# EAGLE design MQTT_meteo_v2.0 (EAGLE 9.0.1)
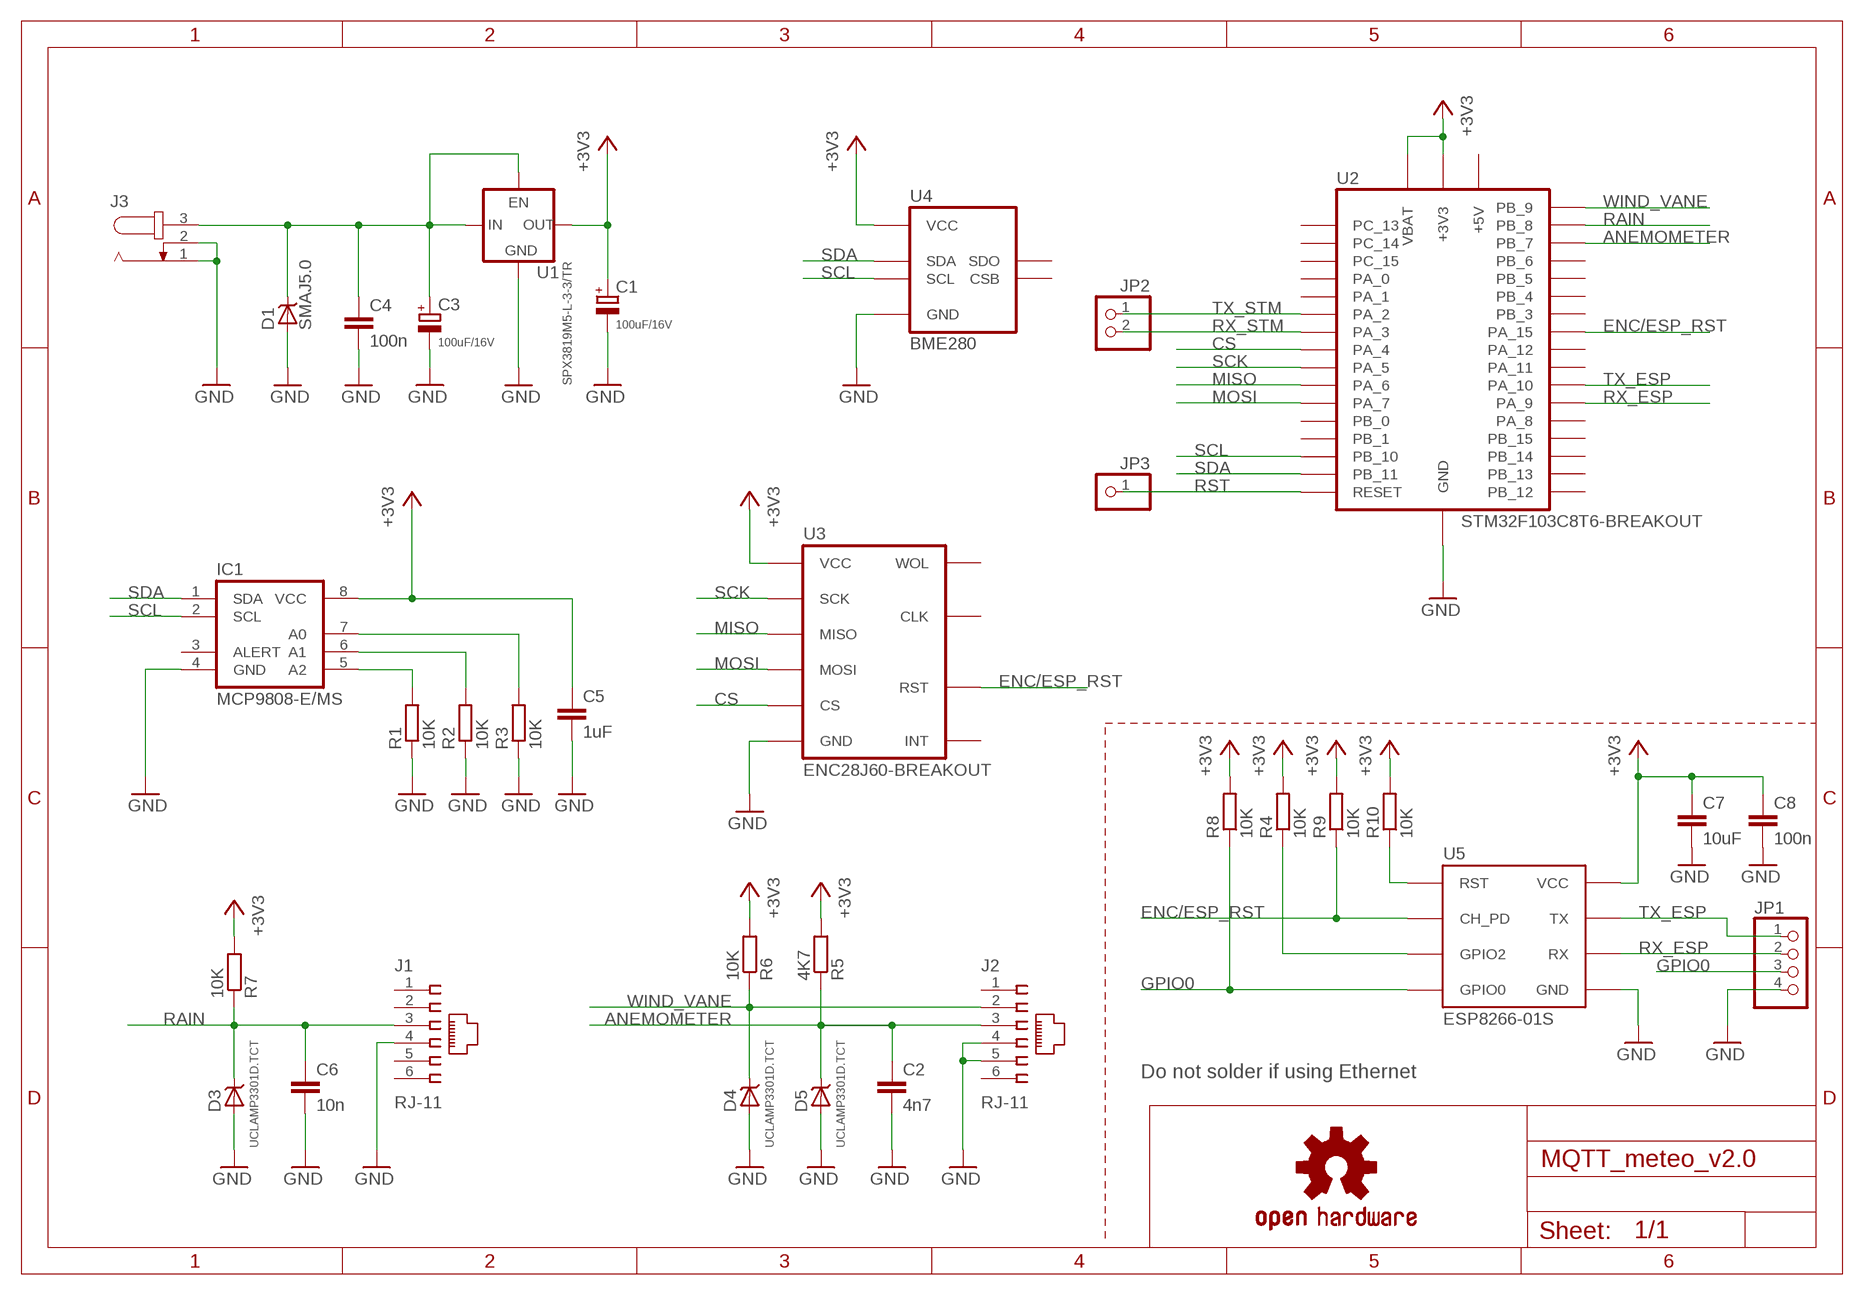
[diagram p0: schematic, sheet 1]

## Parts
C1  100uF/16V  CPOL-EUE2-5  [E2-5]
C2  4n7  C-EUC0805  [C0805]
C3  100uF/16V  CPOL-EUE2-5  [E2-5]
C4  100n  C-EUC0805  [C0805]
C5  1uF  C-EUC0805  [C0805]
C6  10n  C-EUC0805  [C0805]
C7  10uF  C-EUC0805  [C0805]
C8  100n  C-EUC0805  [C0805]
D1  SMAJ5.0  [DO214AC]
D3  UCLAMP3301D.TCT  [SOD323]
D4  UCLAMP3301D.TCT  [SOD323]
D5  UCLAMP3301D.TCT  [SOD323]
IC1  MCP9808-E/MS  [MSOP8]
J1  RJ-11  [615006138421]
J2  RJ-11  [615006138421]
J3  JACK-PLUG1  [SPC4078]
JP1  PINHD-1X4  [1X04]
JP2  PINHD-1X2  [1X02]
JP3  PINHD-1X01_2.54-90°  [1X01/90]
LOGO1  OSHW-LOGOM-COPPER  [OSHW-LOGO-M_COPPER]
R1  10K  R-EU_R0805  [R0805]
R2  10K  R-EU_R0805  [R0805]
R3  10K  R-EU_R0805  [R0805]
R4  10K  R-EU_R0805  [R0805]
R5  4K7  R-EU_R0805  [R0805]
R6  10K  R-EU_R0805  [R0805]
R7  10K  R-EU_R0805  [R0805]
R8  10K  R-EU_R0805  [R0805]
R9  10K  R-EU_R0805  [R0805]
R10  10K  R-EU_R0805  [R0805]
U1  SPX3819M5-L-3-3/TR  TLV70033DD  [SOT23-5]
U2  STM32F103C8T6-BREAKOUT  [STM32F103C8T6]
U3  ENC28J60-BREAKOUT  [ENC28J60]
U4  BME280  [BM*280]
U5  ESP8266-01S  [ESP-01]

## Nets
+3V3: C1.+ C5.1 C7.1 C8.1 IC1.8(VCC) R4.2 R5.2 R6.2 R7.2 R8.2 R9.2 R10.2 U1.5(VOUT) U2.+3V3 U2.+3V3@1(+3V3) U2.VBAT U3.VCC U4.VCC U5.VCC
ANEMOMETER: C2.1 D5.C J2.3 R5.1 U2.PB_7
CS: U2.PA_4 U3.CS
ENC/ESP_RST: R9.1 U2.PA_15 U3.RST U5.CH_PD
GND: C1.- C2.2 C3.- C4.2 C5.2 C6.2 C7.2 C8.2 D1.A D3.A D4.A D5.A IC1.4(GND) J1.4 J2.4 J2.5 J3.1 J3.2 JP1.4 R1.1 R2.1 R3.1 U1.2(GND) U2.GND U2.GND@1(GND) U2.GND@2(GND) U3.GND U4.GND U5.GND
GPIO0: JP1.3 R8.1 U5.GPIO0
MISO: U2.PA_6 U3.SO(MISO)
MOSI: U2.PA_7 U3.SI(MOSI)
N$1: R4.1 U5.GPIO2
N$3: IC1.5(A2) R1.2
N$4: IC1.6(A1) R2.2
N$5: R10.1 U5.RST
N$6: IC1.7(A0) R3.2
RAIN: C6.1 D3.C J1.3 R7.1 U2.PB_8
RST: JP3.1 U2.RESET
RX_ESP: JP1.2 U2.PA_9 U5.RX
RX_STM: JP2.2 U2.PA_3
SCK: U2.PA_5 U3.SCK
SCL: IC1.2(SCL) U2.PB_10 U4.SCL
SDA: IC1.1(SDA) U2.PB_11 U4.SDA
TX_ESP: JP1.1 U2.PA_10 U5.TX
TX_STM: JP2.1 U2.PA_2
VIN: C3.+ C4.1 D1.C J3.3 U1.1(VIN) U1.3(EN)
WIND_VANE: D4.C J2.2 R6.1 U2.PB_9
Unconnected: IC1.3(ALERT) J1.1 J1.2 J1.5 J1.6 J2.1 J2.6 U2.PA_0 U2.PA_1 U2.PA_8 U2.PA_11 U2.PA_12 U2.PB_0 U2.PB_1 U2.PB_3 U2.PB_4 U2.PB_5 U2.PB_6 U2.PB_12 U2.PB_13 U2.PB_14 U2.PB_15 U2.PC_13 U2.PC_14 U2.PC_15 U3.CLK U3.NT(INT) U3.WOL U4.CSB U4.SDO

## Notes on the sheet
- Do not solder if using Ethernet

## Power pins joined to a net without a drawn wire
+5V: U2.+5V

## Library data of the parts
C1 C3 = rcl:CPOL-EU: POLARIZED CAPACITOR, European symbol; SPICEPREFIX: C
C2 C4-C8 = rcl:C-EU: CAPACITOR, European symbol; SPICEPREFIX: C
D1 = my-diode:SM?J*: Transient Voltage Suppression Diode - TVS
D3-D5 = my-diode:UCLAMP3301?.TCT: Low Voltage μClamp TVS diode
IC1 = my-ic:MCP9808-E/?: I2C Digital Temperature Sensor
J1 J2 = my-connectors:RJ-11
J3 = con-jack:JACK-PLUG: DC POWER JACK Power Jack, DC, Right Angle, Through Hole, Rated 5A at 16VDC, PC Terminals Distributor: Farnell (www.Farnell.de) Drawing: 84N1161.pdf / 84N1162.pdf Manufacturer: SPC Technology (www.spctechnology.com) Type: SPC4077 / SPC 4078; OC_FARNELL: unknown; OC_NEWARK: unknown
JP1 = pinhead:PINHD-1X4: PIN HEADER
JP2 = pinhead:PINHD-1X2: PIN HEADER
JP3 = pinhead-2:PINHD-1X01: PIN HEADER
LOGO1 = SparkFun-Aesthetics:OSHW-LOGO: Open-Source Hardware (OSHW) Logo This logo indicates the piece of hardware it is found on incorporates a OSHW license and/or adheres to the definition of open source hardware found here: http://freedomdefined.org/OSHW
R1-R10 = rcl:R-EU_: RESISTOR, European symbol; SPICEPREFIX: R
U1 = my-power:TLV700*: LDO regulator 200mA
U2 = my-modules:STM32F103C8T6-BREAKOUT: 32bit ARM processor breakout board
U3 = my-modules:ENC28J60-BREAKOUT: SPI Ethernet module
U4 = my-modules:BM*280: Pressure/Temp Sensor
U5 = my-ESP8266:ESP8266-01

## Board
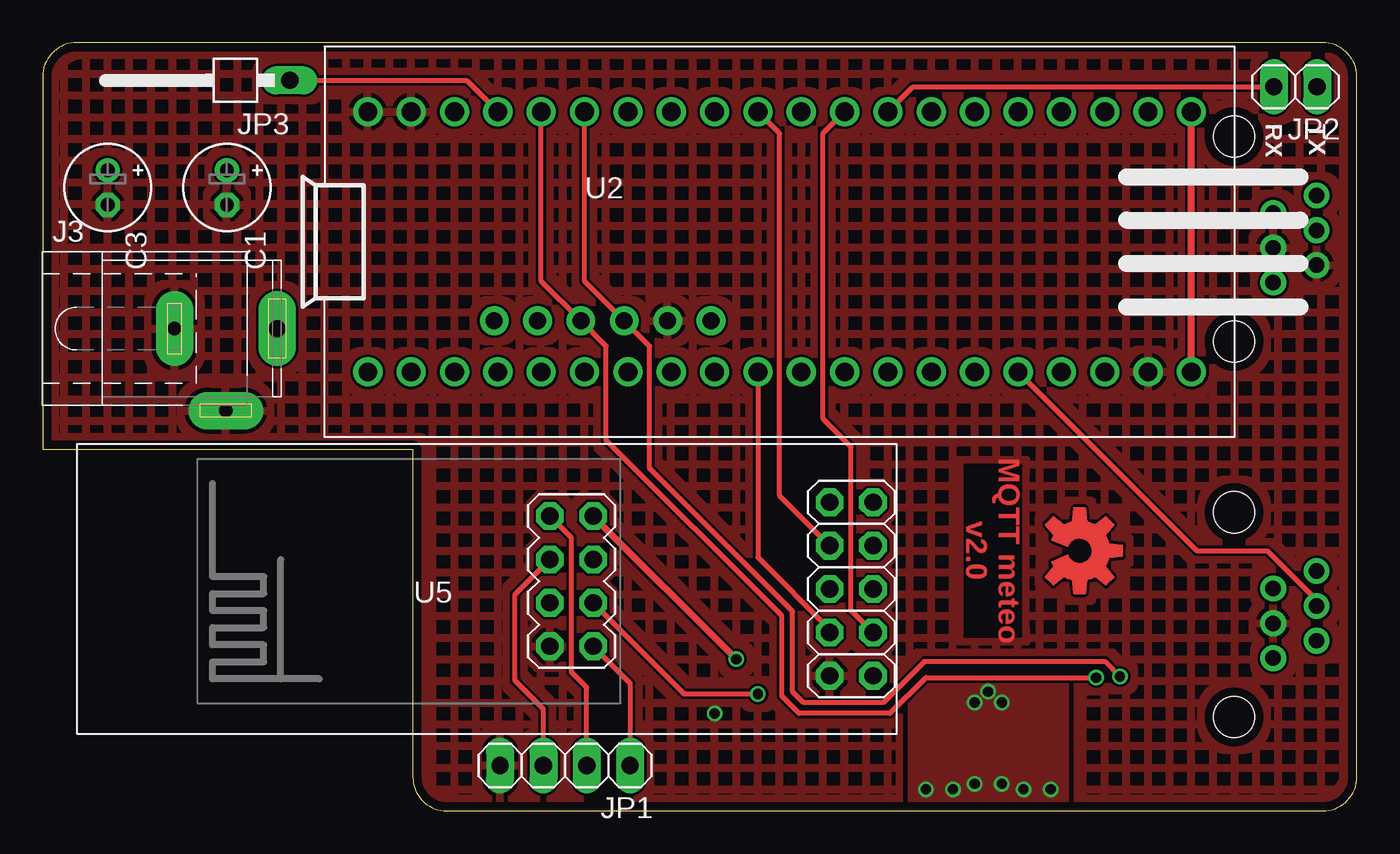
[diagram p1: board, top side]
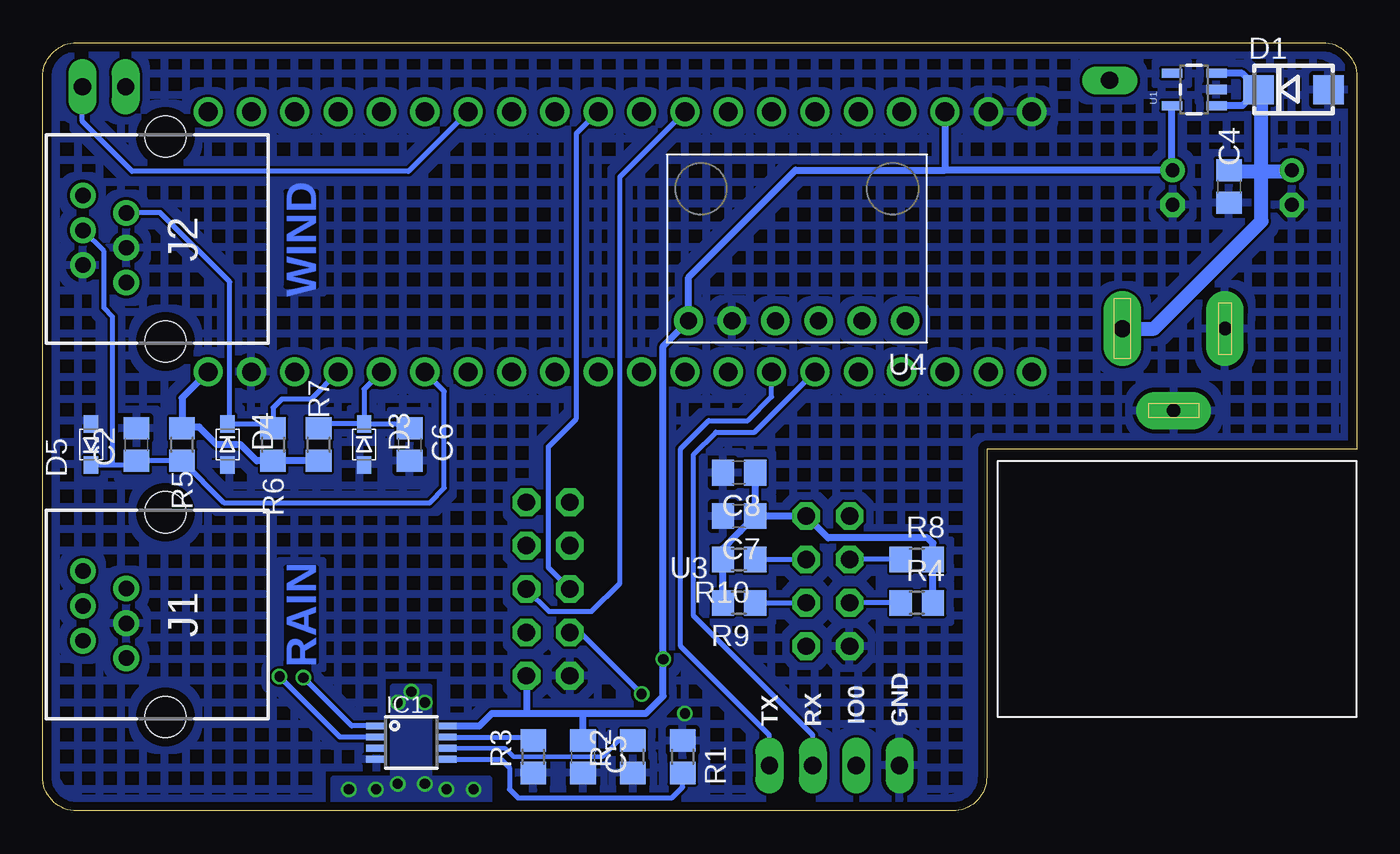
[diagram p2: board, bottom side, seen from below]

Size 77 x 45 mm. Coordinates in mm from the lower left corner, seen from the top.
Outline: 21.68,21.18 21.68,2 arc90 23.68,0 75,0 arc90 77,2 77,43 arc90 75,45 2,45 arc90 0,43 0,21.18 21.68,21.18
Copper layers (1*16): Top 0.035mm / dielectric 1.6mm / Bottom 0.035mm
Design rules "Elecrow_2-layer_PCB_eagle_rule *": minimum track width 6mil, minimum drill 12mil, track to track 6mil, track to pad 6mil, pad to pad 6mil, via to via 8mil, smd to smd 0mil, copper to edge 20mil, drill to drill 10mil, minimum pad ring 12mil, minimum via ring 6mil, stop-mask expansion 0mil, vias tented up to drill 100mil, thermal gap 10mil

### Footprints (pad centres in the part's own frame; a part is rotated, then mirrored left to right if it is on the bottom)
E2-5 = drill 0.813 pad 1.27: + -1.016,0 | drill 0.813 pad 1.27 octagon: - 1.016,0
C0805 = smd 1.3 x 1.5: 1 -0.95,0; 2 0.95,0
DO214AC = smd 1.8 x 1.7: A 2.05,0; C -2.05,0
SOD323 = smd 1.03 x 0.839: A 1.206,0; C -1.206,0
MSOP8 = smd 0.4 x 1.2: 1 -0.975,-2.05; 2 -0.325,-2.05; 3 0.325,-2.05; 4 0.975,-2.05; 5 0.975,2.05; 6 0.325,2.05; 7 -0.325,2.05; 8 -0.975,2.05
615006138421 = drill 0.9: 1 2.55,4.34; 2 1.53,1.8; 3 0.51,4.34; 4 -0.51,1.8; 5 -1.53,4.34; 6 -2.55,1.8 | hole 2.4: -6,-0.5; 6,-0.5
SPC4078 = drill 0.8 pad 2.184 long: 1 -3,0; 2 0,-4.8 | drill 1 pad 2.184 long: 3 3,0
1X04 = drill 1.016 long: 1 -3.81,0; 2 -1.27,0; 3 1.27,0; 4 3.81,0
1X02 = drill 1.016 long: 1 -1.27,0; 2 1.27,0
1X01/90 = drill 1.016 long: 1 -1.27,-3.81
R0805 = smd 1.3 x 1.5: 1 -0.95,0; 2 0.95,0
SOT23-5 = smd 0.55 x 1.2: 1 -0.95,-1.3; 2 0,-1.3; 3 0.95,-1.3; 4 0.95,1.3; 5 -0.95,1.3
STM32F103C8T6 = drill 1.1 pad 1.676: +3V3 -7.62,-19.05; +3V3@1 7.62,24.13; +5V 7.62,19.05; GND -7.62,-24.13; GND@1 -7.62,-21.59; GND@2 7.62,21.59; PA_0 -7.62,13.97; PA_1 -7.62,11.43; PA_2 -7.62,8.89; PA_3 -7.62,6.35; PA_4 -7.62,3.81; PA_5 -7.62,1.27; PA_6 -7.62,-1.27; PA_7 -7.62,-3.81; PA_8 7.62,-13.97; PA_9 7.62,-11.43; PA_10 7.62,-8.89; PA_11 7.62,-6.35; PA_12 7.62,-3.81; PA_15 7.62,-1.27; PB_0 -7.62,-6.35; PB_1 -7.62,-8.89; PB_3 7.62,1.27; PB_4 7.62,3.81; PB_5 7.62,6.35; PB_6 7.62,8.89; PB_7 7.62,11.43; PB_8 7.62,13.97; PB_9 7.62,16.51; PB_10 -7.62,-11.43; PB_11 -7.62,-13.97; PB_12 7.62,-24.13; PB_13 7.62,-21.59; PB_14 7.62,-19.05; PB_15 7.62,-16.51; PC_13 -7.62,21.59; PC_14 -7.62,19.05; PC_15 -7.62,16.51; RESET -7.62,-16.51; VBAT -7.62,24.13
ENC28J60 = drill 1.016 octagon: CLK -23.622,5.08; CS -23.622,-2.54; GND -21.082,-5.08; NT -21.082,5.08; RST -21.082,-2.54; SCK -21.082,0; SI -23.622,0; SO -21.082,2.54; VCC -23.622,-5.08; WOL -23.622,2.54
BM*280 = drill 1 pad 1.676: CSB -3.81,3.81; GND 3.81,3.81; SCL 1.27,3.81; SDA -1.27,3.81; SDO -6.35,3.81; VCC 6.35,3.81
ESP-01 = drill 1.016 octagon: CH_PD -10.795,1.27; GND -8.255,3.81; GPIO0 -8.255,-1.27; GPIO2 -8.255,1.27; RST -10.795,-1.27; RX -8.255,-3.81; TX -10.795,3.81; VCC -10.795,-3.81

### Placement (x,y rotation side)
C1  10.79,36.51 270 top
C2  71.5,21.46 90 bottom
C3  3.81,36.51 270 top
C4  7.49,36.58 270 bottom
C5  45.34,3.17 270 bottom
C6  55.5,21.46 270 bottom
C7  36.2,17.27 180 bottom
C8  36.2,19.81 180 bottom
D1  3.71,42.25 0 bottom
D3  58.17,21.46 270 bottom
D4  66.17,21.46 270 bottom
D5  74.17,21.46 90 bottom
IC1  55.4,4 270 bottom
J1  70.3,11.5 90 bottom
J2  70.3,33.5 90 bottom
J3  10.73,28.25 0 top
JP1  30.61,2.67 180 top
JP2  73.41,42.42 180 top
JP3  10.67,44.07 90 top
LOGO1  60.76,15.24 270 top
R1  39.5,3.17 270 bottom
R2  42.42,3.17 90 bottom
R3  48.26,3.17 90 bottom
R4  25.78,12.19 0 bottom
R5  68.83,21.46 90 bottom
R6  63.5,21.46 270 bottom
R7  60.83,21.46 270 bottom
R8  25.78,14.73 0 bottom
R9  36.2,12.19 180 bottom
R10  36.2,14.73 180 bottom
U1  9.53,42.26 90 bottom
U2  43.18,33.34 270 top
U3  25.03,13 0 bottom
U4  32.81,32.52 180 bottom
U5  21.46,13.46 180 top

### Tracks (layer width: path | path; a pad name or v marks a point on that pad's centre or on a via)
+3V3  (via drill 0.6)
  Top 0.406: U2.+3V3@1 U2.VBAT | U5.VCC v40.64,8.89
  Bottom 0.406: 24.13,37.53 C1.+ 10.83,37.56 U1.5 | IC1.8 51.41,4.98 50.67,5.71 48.64,5.71 | 48.64,5.71 45.34,5.71 | U3.VCC 48.65,5.73 48.64,5.71 | U2.+3V3@1 68.83,24.19 68.83,22.48 | 68.83,22.48 R5.2 | R7.2 R6.2 64.45,20.51 65.41,21.46 66.8,21.46 67.82,22.48 68.83,22.48 | 24.13,37.53 32.88,37.53 39.16,31.25 U4.VCC 40.64,27.23 v40.64,8.89 40.64,6.73 41.66,5.71 45.34,5.71 | U2.+3V3 24.13,37.53 | C5.1 45.34,5.71 | R4.2 R8.2 24.83,15.69 25.15,16 30.99,16 U5.VCC C7.1 | C7.1 36.14,16.38 36.35,16.17 37.15,15.37 R10.2 R9.2 | C7.1 C8.1
ANEMOMETER
  Bottom 0.305: 72.9,20.26 71.76,20.26 C2.1 R5.1 66.36,18.03 54.36,18.03 53.47,18.92 53.47,24.57 U2.PB_7 | 72.9,20.26 D5.C | J2.3 73.41,32.78 73.41,29.46 72.9,28.96 72.9,20.26
CS
  Top 0.305: U3.CS 47.37,11.74 47.37,21.34 45.72,22.99 45.72,39.69 U2.PA_4
ENC/ESP_RST  (via drill 0.6)
  Top 0.305: U5.CH_PD 37.59,6.86 v41.91,6.86 | U2.PA_15 41.91,14.86 46.11,10.65 U3.RST
  Bottom 0.305: R9.1 U5.CH_PD | v41.91,6.86 45.51,10.46 U3.RST
GND  (via drill 0.6)
  other vias: 39.37,5.71
  pour Bottom (hatched): 0,45 0,0 50.16,0 50.16,2.54 53.66,2.54 53.66,7.94 57.15,7.94 57.15,2.54 60.64,2.54 60.64,0 77,0 77,45
  pour Top (hatched): 0,0 0,45 77,45 77,0 60.64,0 60.64,8.26 51.44,8.26 50.16,6.99 50.16,0
GPIO0
  Top 0.305: JP1.3 29.34,5.97 27.69,7.62 27.69,12.7 U5.GPIO0
  Bottom 0.305: R8.1 U5.GPIO0
HEATSINK  (via drill 0.6)
  other vias: 54.61,6.35 54.61,1.59 56.2,1.59 56.2,6.35 53.34,1.27 51.75,1.27 57.47,1.27 59.05,1.27 55.4,6.99
  pour Bottom: 54.29,1.91 54.29,7.3 56.52,7.3 56.52,1.91 60.01,1.91 60.01,0 50.8,0 50.8,1.91
  pour Top: 60.01,7.62 52.07,7.62 50.8,6.35 50.8,0 60.01,0
MISO
  Top 0.305: U3.SO 43.18,18.47 43.18,39.69 U2.PA_6
MOSI
  Bottom 0.305: U3.SI 47.34,11.68 44.83,11.68 43.18,13.34 43.18,37.15 U2.PA_7
N$1
  Bottom 0.305: R4.1 U5.GPIO2
N$3
  Bottom 0.305: IC1.5 50.15,3.03 49.66,2.54 49.66,1.27 49.15,0.76 40.13,0.76 39.5,1.4 R1.2
N$4
  Bottom 0.254: R2.2 43.25,4.12 44.2,3.17 49.4,3.17 49.91,3.68 IC1.6
N$5
  Bottom 0.305: R10.1 U5.RST
N$6
  Bottom 0.305: IC1.7 48.47,4.33 R3.2
RAIN
  Top 0.305: U2.PB_8 67.63,15.24 71.75,15.24 74.64,12.36 J1.3
  Bottom 0.305: D3.C 55.76,22.67 C6.1 | D3.C 60.58,22.67 R7.1 | U2.PB_8 58.17,24.7 D3.C
RST
  Top 0.305: JP3.1 24.83,42.8 U2.RESET
RX_ESP
  Top 0.305: U5.RX 30.99,16 30.99,8.13 31.88,7.24 JP1.2
  Bottom 0.305: U2.PA_9 35.28,22.19 37.55,22.19 38.86,20.88 38.86,11.43 31.88,4.45 JP1.2
RX_STM
  Top 0.305: U2.PA_3 50.99,42.42 JP2.2
SCK
  Bottom 0.305: U3.SCK 47.37,14.26 47.37,21.34 45.72,22.99 45.72,39.69 U2.PA_5
SCL  (via drill 0.6)
  Top 0.305: v63.12,7.87 62.23,8.76 51.69,8.76 49.28,6.35 44.58,6.35 43.94,6.99 43.94,11.68 35.56,20.07 35.56,27.23 U4.SCL 31.75,31.04 U2.PB_10
  Bottom 0.305: IC1.2 59.58,4.33 v63.12,7.87
SDA  (via drill 0.6)
  Top 0.305: v61.72,7.81 51.75,7.81 49.66,5.71 44.32,5.71 43.31,6.73 43.31,11.43 33.02,21.72 33.02,27.23 U4.SDA 29.21,31.04 U2.PB_11
  Bottom 0.305: IC1.1 58.89,4.98 v61.72,7.81
TX_ESP
  Top 0.305: U5.TX 34.42,7.49 JP1.1
  Bottom 0.305: U2.PA_10 34.29,24.26 35.69,22.86 37.97,22.86 39.62,21.21 39.62,9.65 34.42,4.45 JP1.1
TX_STM
  Bottom 0.305: U2.PA_2 55.56,37.47 71.75,37.47 74.68,40.39 JP2.1
VIN
  Bottom 0.406: U1.3 6.72,43.21 D1.C 6.71,41.31 U1.1
  Bottom 0.813: J3.3 11.88,28.25 5.59,34.54 5.59,37.47 | 5.59,37.47 5.59,42.08 D1.C | C4.1 7.43,37.47 5.59,37.47 | 5.59,37.47 3.87,37.47 C3.+
WIND_VANE
  Bottom 0.305: J2.2 72.08,35.05 70.1,35.05 66.04,30.99 66.04,22.8 D4.C 63.76,22.67 R6.1 63.5,23.62 62.99,24.13 61.28,24.13 U2.PB_9

### Text on the board
Top: MQTT meteo / v2.0
Bottom: WIND | RAIN
tPlace: RX | TX
bPlace: GND | IO0 | RX | TX
bStop: WIND | RAIN